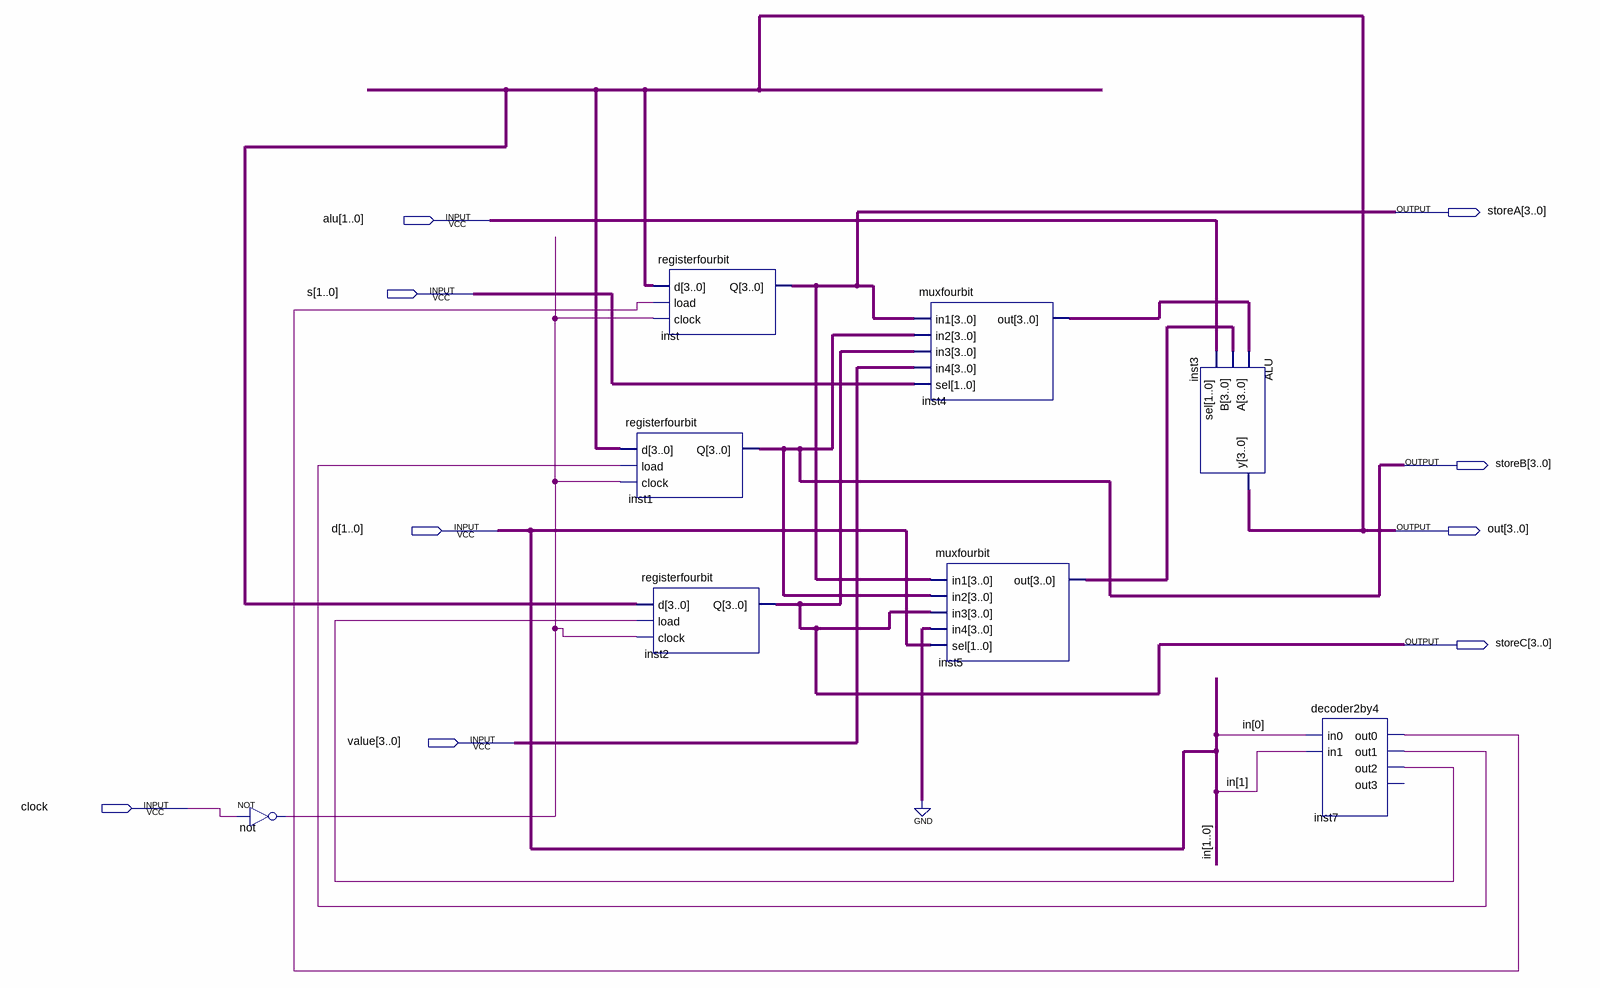
[diagram p0: schematic sheet]
// Quartus schematic EU.bdf as structural Verilog: 8 symbols, 9 pins
module EU (
  input  [1:0] alu,
  input  [1:0] s,
  input  [1:0] d,
  input  [3:0] value,
  input  clock,
  output [3:0] storeA,
  output [3:0] storeB,
  output [3:0] out,
  output [3:0] storeC
);

  wire inst7_out0, inst7_out1, inst7_out2, not_out;
  wire [3:0] inst4_out, inst5_out;

  not \not  (not_out, clock);
  registerfourbit inst (.d(out), .load(inst7_out0), .clock(not_out), .Q(storeA));
  registerfourbit inst1 (.d(out), .load(inst7_out1), .clock(not_out), .Q(storeB));
  registerfourbit inst2 (.d(out), .load(inst7_out2), .clock(not_out), .Q(storeC));
  muxfourbit inst4 (.in1(storeA), .in2(storeB), .in3(storeC), .in4(value), .sel(s), .out(inst4_out));
  muxfourbit inst5 (.in1(storeA), .in2(storeB), .in3(storeC), .in4(4'b0000), .sel(d), .out(inst5_out));
  ALU inst3 (.A(inst4_out), .B(inst5_out), .sel(alu), .y(out));
  decoder2by4 inst7 (.in0(d[0]), .in1(d[1]), .out0(inst7_out0), .out1(inst7_out1), .out2(inst7_out2));  // open: out3

  // Other names for the same wires on the sheet: in[1:0] = d
endmodule
